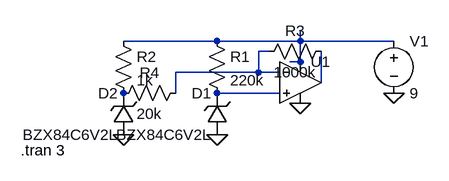
[diagram p0: schematic noise generator.asc]
noise generator.asc, the LTspice schematic file:
Version 4
SHEET 1 880 680
WIRE 336 0 192 0
WIRE 464 0 464 -16
WIRE 464 0 336 0
WIRE 608 0 464 0
WIRE 416 16 400 16
WIRE 464 32 464 0
WIRE 464 32 448 32
WIRE 400 48 400 16
WIRE 400 48 272 48
WIRE 432 48 400 48
WIRE 496 64 496 16
WIRE 272 80 272 48
WIRE 432 80 336 80
FLAG 336 144 0
FLAG 192 144 0
FLAG 608 80 0
FLAG 464 96 0
SYMBOL zener 208 144 R180
WINDOW 0 24 64 Left 2
WINDOW 3 24 0 Left 2
SYMATTR InstName D2
SYMATTR Value BZX84C6V2L
SYMATTR Description Diode
SYMATTR Type diode
SYMBOL res 176 -16 R0
SYMATTR InstName R2
SYMATTR Value 1k
SYMBOL zener 352 144 R180
WINDOW 0 24 64 Left 2
WINDOW 3 24 0 Left 2
SYMATTR InstName D1
SYMATTR Value BZX84C6V2L
SYMATTR Description Diode
SYMATTR Type diode
SYMBOL res 320 -16 R0
SYMATTR InstName R1
SYMATTR Value 220k
SYMBOL res 288 64 R90
WINDOW 0 0 56 VBottom 2
WINDOW 3 32 56 VTop 2
SYMATTR InstName R4
SYMATTR Value 20k
SYMBOL Opamps\\UniversalOpamp2 464 64 R0
SYMATTR InstName U1
SYMBOL voltage 608 -16 R0
WINDOW 123 0 0 Left 0
WINDOW 39 0 0 Left 0
SYMATTR InstName V1
SYMATTR Value 9
SYMBOL res 512 0 R90
WINDOW 0 0 56 VBottom 2
WINDOW 3 32 56 VTop 2
SYMATTR InstName R3
SYMATTR Value 1000k
TEXT 34 168 Left 2 !.tran 3

The netlist it stands for:
* noise generator.asc
D2 0 P001 BZX84C6V2L
R2 N001 P001 1k
D1 0 N004 BZX84C6V2L
R1 N001 N004 220k
R4 N002 P001 20k
XU1 N004 N002 N001 0 N003 level.2 Avol=1Meg GBW=10Meg Slew=10Meg ilimit=25m rail=0 Vos=0 phimargin=45 en=0 enk=0 in=0 ink=0 Rin=500Meg  ; pins IN+ IN- V+ V- OUT
V1 N001 0 9
R3 N003 N002 1000k
.model D D
.lib standard.dio
.tran 3
.lib UniversalOpamps2.sub
.backanno
.end